# EAGLE design CROSSOVER_MONO_FINISHED_KRE_rev3_dec (EAGLE 7.1.0)
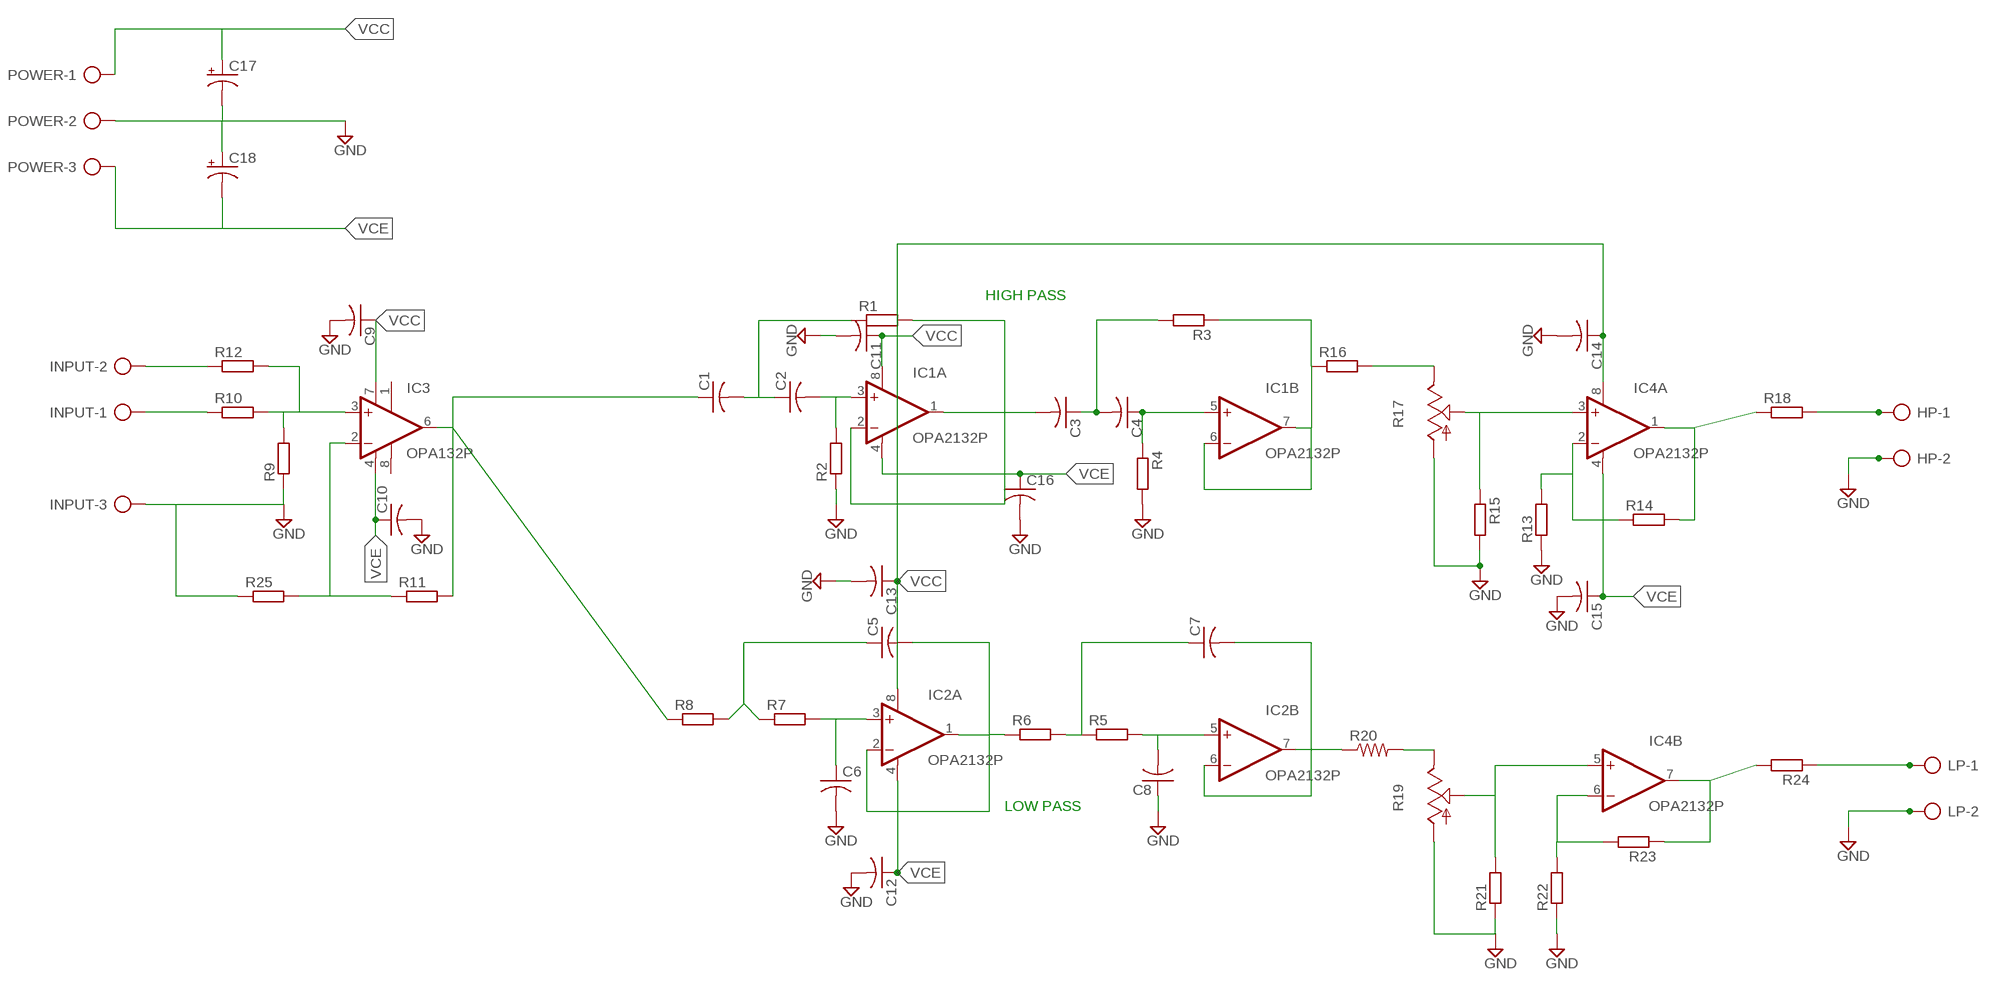
[diagram p0: schematic, sheet 1]

## Parts
C1  C-US050-025X075  [C050-025X075]
C2  C-US050-025X075  [C050-025X075]
C3  C-US050-025X075  [C050-025X075]
C4  C-US050-025X075  [C050-025X075]
C5  C-US050-025X075  [C050-025X075]
C6  C-US050-025X075  [C050-025X075]
C7  C-US050-025X075  [C050-025X075]
C8  C-US050-025X075  [C050-025X075]
C9  C-US050-025X075  [C050-025X075]
C10  C-US050-025X075  [C050-025X075]
C11  C-US050-025X075  [C050-025X075]
C12  C-US050-025X075  [C050-025X075]
C13  C-US050-025X075  [C050-025X075]
C14  C-US050-025X075  [C050-025X075]
C15  C-US050-025X075  [C050-025X075]
C16  C-US050-025X075  [C050-025X075]
C17  CPOL-USE5-10.5  [E5-10,5]
C18  CPOL-USE5-10.5  [E5-10,5]
HP  KRE_2VIAS  [KRE_2VIAS]
IC1  OPA2132P  [DIL08]
IC2  OPA2132P  [DIL08]
IC3  OPA132P  [DIL08]
IC4  OPA2132P  [DIL08]
INPUT  KRE_3VIAS  [KRE_3VIAS]
LP  KRE_2VIAS  [KRE_2VIAS]
POWER  KRE_3VIAS  [KRE_3VIAS]
R1  R-EU_0207/10  [0207/10]
R2  R-EU_0207/10  [0207/10]
R3  R-EU_0207/10  [0207/10]
R4  R-EU_0207/10  [0207/10]
R5  R-EU_0207/10  [0207/10]
R6  R-EU_0207/10  [0207/10]
R7  R-EU_0207/10  [0207/10]
R8  R-EU_0207/10  [0207/10]
R9  R-EU_0207/10  [0207/10]
R10  R-EU_0207/10  [0207/10]
R11  R-EU_0207/10  [0207/10]
R12  R-EU_0207/10  [0207/10]
R13  R-EU_0207/10  [0207/10]
R14  R-EU_0207/10  [0207/10]
R15  R-EU_0207/10  [0207/10]
R16  R-EU_0207/10  [0207/10]
R17  TRIM_US-RJ9W  [RJ9W]
R18  R-EU_0207/10  [0207/10]
R19  TRIM_US-RJ9W  [RJ9W]
R20  R-US_0204/7  [0204/7]
R21  R-EU_0207/10  [0207/10]
R22  R-EU_0207/10  [0207/10]
R23  R-EU_0207/10  [0207/10]
R24  R-EU_0207/10  [0207/10]
R25  R-EU_0207/10  [0207/10]

## Nets
GND: C6.2 C8.1 C9.2 C10.2 C11.2 C12.2 C13.2 C14.2 C15.2 C16.2 C17.- C18.+ HP.2 INPUT.3 LP.2 POWER.2 R2.1 R4.2 R9.1 R13.1 R15.2 R17.A R19.A R21.1 R22.1 R25.1
N$1: C3.1 C4.2 R3.2
N$2: C5.2 IC2.1(A:OUT) IC2.2(A:-IN) R6.1
N$3: C6.1 IC2.3(A:+IN) R7.2
N$4: C5.1 R7.1 R8.2
N$5: C7.2 IC2.6(B:-IN) IC2.7(B:OUT) R20.1
N$6: C7.1 R5.1 R6.2
N$7: C8.2 IC2.5(B:+IN) R5.2
N$8: IC1.6(B:-IN) IC1.7(B:OUT) R3.1 R16.1
N$9: C2.2 IC1.3(A:+IN) R2.2
N$10: C4.1 IC1.5(B:+IN) R4.1
N$11: C3.2 IC1.1(A:OUT) IC1.2(A:-IN) R1.2
N$12: C1.1 IC3.6(OUT) R8.1 R11.2
N$13: C1.2 C2.1 R1.1
N$14: IC3.3(+IN) R9.2 R10.2 R12.2
N$15: INPUT.1 R10.1
N$17: IC3.2(-IN) R11.1 R25.2
N$18: INPUT.2 R12.1
N$19: IC4.1(A:OUT) R14.2 R18.1
N$20: IC4.2(A:-IN) R13.2 R14.1
N$22: R16.2 R17.E
N$23: IC4.3(A:+IN) R15.1 R17.S
N$24: HP.1 R18.2
N$25: R19.E R20.2
N$26: LP.1 R24.1
N$27: IC4.7(B:OUT) R23.1 R24.2
N$29: IC4.6(B:-IN) R22.2 R23.2
N$30: IC4.5(B:+IN) R19.S R21.2
VCC: C9.1 C11.1 C13.1 C14.1 C17.+ IC1.8(A:V+) IC2.8(A:V+) IC3.7(V+) IC4.8(A:V+) POWER.1
VCE: C10.1 C12.1 C15.1 C16.1 C18.- IC1.4(A:V-) IC2.4(A:V-) IC3.4(V-) IC4.4(A:V-) POWER.3
Unconnected: IC3.1(TRIM1) IC3.8(TRIM2)

## Notes on the sheet
- HIGH PASS
- LOW PASS

## Library data of the parts
C1-C16 = resistor:C-US: CAPACITOR, American symbol
C17 C18 = resistor:CPOL-US: POLARIZED CAPACITOR, American symbol
HP LP = Controle_de_pedais:KRE_2VIAS
IC1 IC2 IC4 = burr-brown:OPA2132: High Speed FET-Input Operational Amplifiers< Product Folder:OPA2132; MPN: OPA2132P; OC_FARNELL: 1212432; OC_NEWARK: 47P7461
IC3 = burr-brown:OPA132: Operational Amplifiers High Speed FET-Input; OC_FARNELL: unknown; OC_NEWARK: unknown
INPUT POWER = Controle_de_pedais:KRE_3VIAS
R1-R16 R18 R21-R25 = resistor:R-EU_: RESISTOR, European symbol
R17 R19 = pot:TRIM_US-: POTENTIOMETER
R20 = resistor:R-US_: RESISTOR, American symbol

## Board
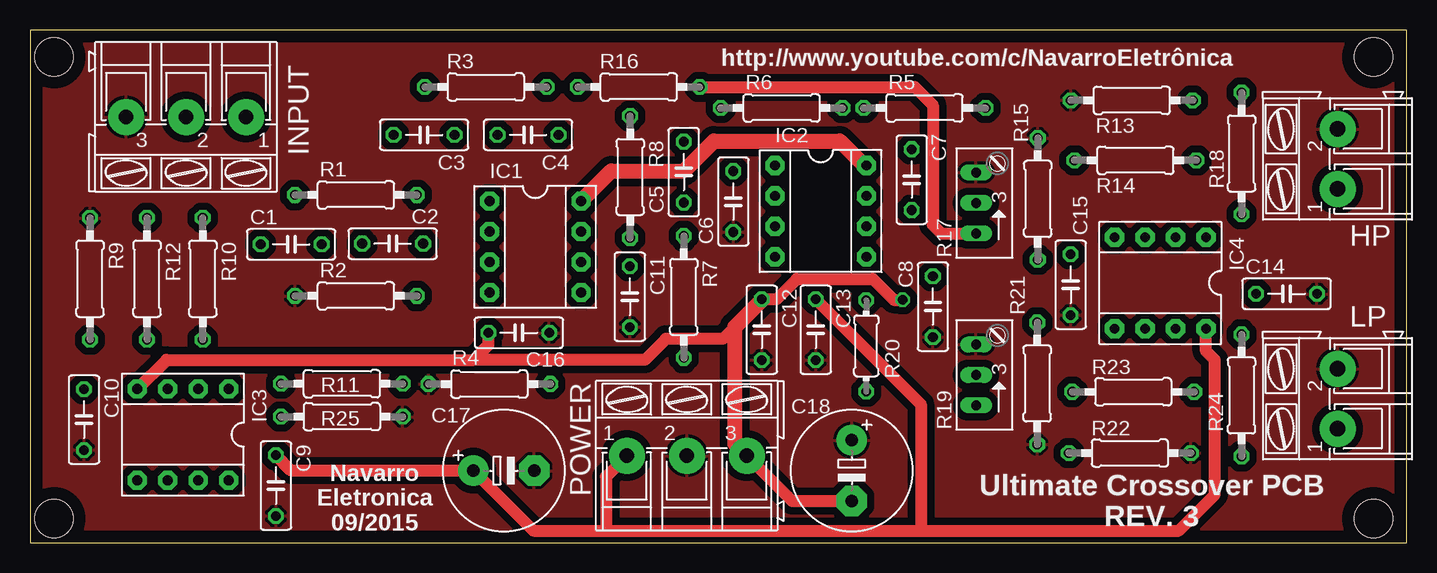
[diagram p1: board, top side]
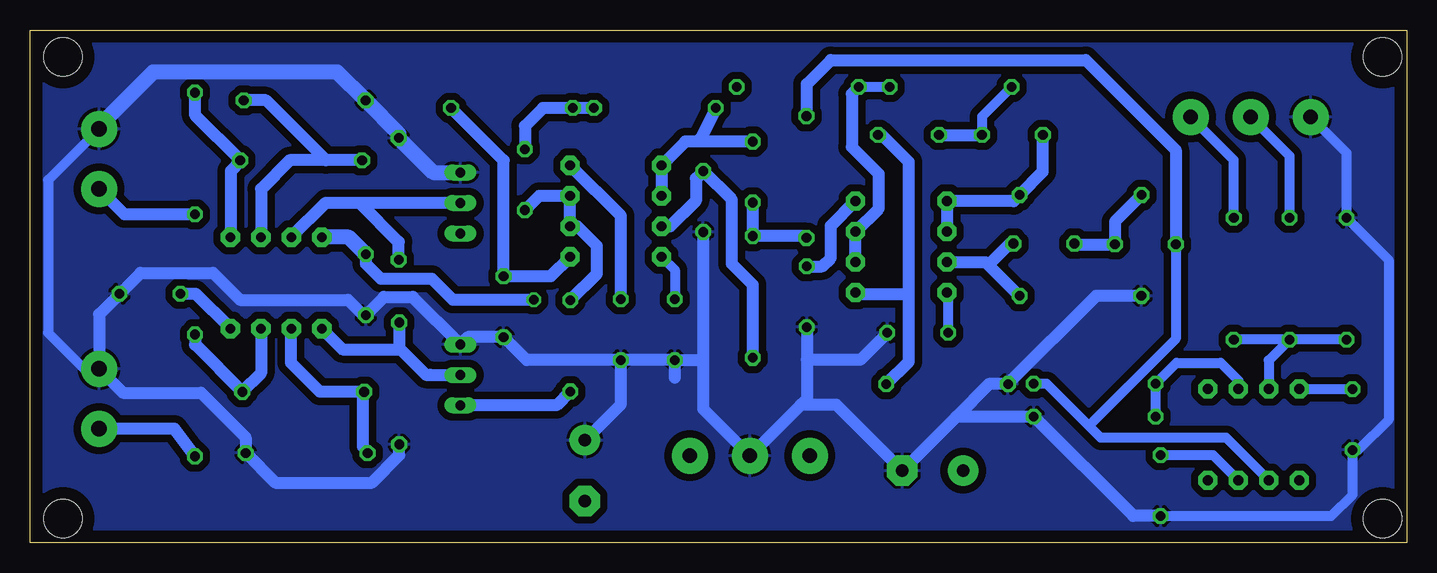
[diagram p2: board, bottom side, seen from below]

Size 114.75 x 42.75 mm. Coordinates in mm from the lower left corner, seen from the top.
Outline: 0,0 114.75,0 114.75,42.75 0,42.75 0,0
Copper layers (1*16): Top 0.035mm / dielectric 1.5mm / Bottom 0.035mm
Design rules "default": minimum track width 10mil, minimum drill 24mil, track to track 8mil, track to pad 8mil, pad to pad 8mil, via to via 8mil, smd to smd 8mil, copper to edge 40mil, drill to drill 8mil, minimum pad ring 10mil, minimum via ring 8mil, stop-mask expansion 4mil, vias tented up to drill 0mil, thermal gap 10mil
Holes 3.2 mm at 2,40.5 112,40.5 112,2 2,2

### Footprints (pad centres in the part's own frame; a part is rotated, then mirrored left to right if it is on the bottom)
C050-025X075 = drill 0.813 octagon: 1 -2.54,0; 2 2.54,0
E5-10,5 = drill 1.016 pad 2.54: + -2.54,0 | drill 1.016 pad 2.54 octagon: - 2.54,0
KRE_2VIAS = drill 1.321 pad 3: 1 -2.5,0; 2 2.5,0
DIL08 = drill 0.813 pad 1.6 octagon: 1 -3.81,-3.81; 2 -1.27,-3.81; 3 1.27,-3.81; 4 3.81,-3.81; 5 3.81,3.81; 6 1.27,3.81; 7 -1.27,3.81; 8 -3.81,3.81
KRE_3VIAS = drill 1.2 pad 3: 1 -5,0; 2 0,0; 3 5,0
0207/10 = drill 0.813 octagon: 1 -5.08,0; 2 5.08,0
RJ9W = drill 0.813 long: A 2.54,0.635; E -2.54,0.635; S 0,0.635
0204/7 = drill 0.813 octagon: 1 -3.81,0; 2 3.81,0

### Placement (x,y rotation side)
C1  21.77,24.87 0 top
C2  30.23,24.93 0 top
C3  32.85,34 180 top
C4  41.51,34 180 top
C5  54.5,30.9 90 top
C6  58.63,28.44 270 top
C7  73.5,30.26 270 top
C8  75.27,19.67 90 top
C9  20.5,4.75 270 top
C10  4.5,10.25 270 top
C11  50,20.5 270 top
C12  61,17.75 270 top
C13  65.5,17.75 270 top
C14  104.75,20.75 0 top
C15  86.75,21.5 270 top
C16  40.75,17.5 0 top
C17  39.5,6 0 top
C18  68.5,6 270 top
HP  109,32 90 top
IC1  42.12,24.66 270 top
IC2  65.91,27.64 270 top
IC3  12.75,9 180 top
IC4  94.23,21.65 180 top
INPUT  13,35.5 180 top
LP  109,12 90 top
POWER  54.75,7.25 0 top
R1  27.17,28.99 0 top
R2  27.17,20.57 0 top
R3  38,38 180 top
R4  38.3,13.22 180 top
R5  74.57,36.25 0 top
R6  62.66,36.25 0 top
R7  54.5,20.49 270 top
R8  50.03,30.49 270 top
R9  5,22 270 top
R10  14.41,22 270 top
R11  26,13.25 0 top
R12  9.75,22 270 top
R13  91.85,36.88 0 top
R14  92.15,31.88 0 top
R15  84.01,28.66 90 top
R16  50.75,38 0 top
R17  79.5,28.32 90 top
R18  101,32.45 270 top
R19  79.5,13.98 90 top
R20  69.71,16.4 270 top
R21  83.97,13.27 90 top
R22  91.69,7.46 180 top
R23  91.97,12.57 180 top
R24  101,12.27 90 top
R25  26,10.5 180 top

### Tracks (layer width: path | path; a pad name or v marks a point on that pad's centre or on a via)
GND
  Bottom 0.813: INPUT.3 5,32.5 R9.1 1.5,23.58 1.5,10.25 4.04,7.71 C10.2 4.5,4 6.29,2.21 C9.2 | HP.2 113.25,30.25 113.25,17.5 110.25,14.5 LP.2
  Bottom 1.016: R21.1 83.97,7.29 86.25,5 94.31,5 R22.1 96.77,8.77 100.5,12.5 107,12.5 LP.2 109,19.04 C14.2 105.54,22.5 99.5,22.5 97.25,20.25 88.25,20.25 86.96,18.96 C15.2 86.75,19 85.25,20.5 82.85,20.5 R19.A 78.25,17.13 C8.1 73.35,15.21 C13.2 | C12.2 C13.2 | C11.2 50,15.25 | 50,15.25 50,12 50.5,11.5 | 50.5,11.5 POWER.2 58.63,11.13 58.63,15 | C6.2 58.63,15 | C12.2 58.84,15.21 58.63,15 | 61,13.75 C12.2 | 50.5,11.5 47.54,11.5 C17.- 37.54,10.5 | C18.+ 65.5,11.54 C13.2 | C16.2 45.54,15.25 50,15.25 | C9.2 22.79,2.21 R25.1 37.54,10.5 | 37.54,10.5 34.82,13.22 R4.2 25.86,20.57 R2.1
  Bottom 1.27: HP.2 109,34.75 104.5,39.25 89.14,39.25 R13.1 84.01,34.12 R15.2 81.13,30.86 R17.A
  pour Top (isolate 0.61): 0,43 114.75,43 114.75,0 0,0
  pour Bottom (isolate 0.61): 0,42.75 114.75,43 114.75,0 0,-0.25
N$1
  Bottom 0.813: R3.2 35.39,35.53 C3.1
  Bottom 1.016: C4.2 C3.1
N$2
  Bottom 1.016: IC2.2 IC2.1 60.11,33.44 58.5,33.44 | C5.2 58.5,33.44 | R6.1 58.83,33.77 58.5,33.44
N$3
  Bottom 0.813: 61.96,26.23 IC2.3
  Bottom 1.016: R7.2 54.5,21.5 56.25,23.25 56.25,28.6 C6.1 59.25,30.36 59.25,28.5 61.38,26.37 IC2.3
N$4
  Bottom 1.016: R8.2 50.19,25.57 R7.1 C5.1
N$5
  Bottom 1.016: C7.2 72.31,28.91 IC2.7 IC2.6 69.12,26.37 67.5,24.75 67.5,22.42 R20.1
N$6
  Bottom 1.016: R6.2 R5.1 72,36.25 73.5,34.75 C7.1
N$7
  Bottom 1.016: IC2.5 71.34,22.21 C8.2 75.27,31.87 R5.2
N$8
  Bottom 0.813: R3.1 R16.1
  Bottom 1.016: IC1.6 IC1.7 44,27.86 44,30.75 46.25,33 46.25,37.42 R16.1
N$9
  Bottom 1.016: IC1.3 35.07,23.39 34.84,23.16 | 34.84,23.16 R2.2 | C2.2 33.07,24.93 34.84,23.16
N$10
  Bottom 1.016: R4.1 41.5,15.09 41.5,20.75 | 41.5,20.75 41.5,31.75 43.75,34 C4.1 | IC1.5 45.83,20.75 41.5,20.75
N$11
  Bottom 1.016: IC1.2 IC1.1 32.77,28.47 R1.2 30.31,30.93 C3.2
N$12
  Bottom 0.813: IC3.6 15.04,8.75 25.5,8.75 26.38,9.62 | 26.38,9.62 30,13.25 R11.2 | C1.1 19.25,24.86 19.25,17 26.38,9.88 26.38,9.62
  Bottom 1.016: R8.1 50,35.6 50,38.25 48,40.25 26.75,40.25 19.23,32.73 C1.1
N$13
  Bottom 1.016: C2.1 27.63,24.87 C1.2 24.31,26.77 R1.1
N$14
  Bottom 0.813: R9.2 R12.2 | R12.2 R10.2 | R12.2 11.48,15.19 IC3.3
N$15
  Bottom 0.813: R10.1 14.4,31.91 INPUT.1
N$17
  Bottom 0.813: R25.2 R11.1 19.17,15 15.5,15 14.02,13.52 IC3.2
N$18
  Bottom 0.813: R12.1 9.75,32.25 INPUT.2
N$19  (via drill 0.6)
  Bottom 1.016: IC4.1 v98,25.5 98,31 97.23,31.77 R14.2 100.96,35.61 R18.1
N$20
  Bottom 1.016: R13.2 95.07,36.88 90.07,31.88 | R14.1 90.07,31.88 | 90.07,31.88 93.12,31.88 95.5,29.5 IC4.2
N$22
  Top 1.016: R16.2 73.75,38 75.25,36.5 75.25,26.5 75.97,25.78 R17.E
N$23
  Bottom 1.016: R17.S 87.25,28.32 | 87.25,28.32 90.1,28.32 IC4.3 | R15.1 84.01,25.08 87.25,28.32
N$24
  Bottom 1.016: R18.2 106.87,27.37 HP.1
N$25
  Bottom 1.016: R20.2 70.86,11.44 R19.E
N$26
  Bottom 1.016: R24.1 102.7,9.5 LP.1
N$27
  Bottom 1.016: IC4.7 95.5,14.12 R23.1 101,16.52 R24.2
N$29  (via drill 0.6)
  Bottom 1.016: R22.2 86.61,7.61 87,8 87,12.46 R23.2 90.57,12.57 93,15 v93,17.8 IC4.6
N$30
  Bottom 1.016: R21.2 83.97,16.21 83.88,16.12 | 83.88,16.12 81.75,14 81.39,14 R19.S | IC4.5 88.7,16.12 83.88,16.12
N$31  (via drill 0.9)
  other vias: 2,2
N$35  (via drill 0.9)
  other vias: 2,40.5
N$36  (via drill 0.9)
  other vias: 112,40.5
N$37  (via drill 0.9)
  other vias: 112,2
VCC
  Top 1.016: C9.1 21.79,6 C17.+ 41.96,1 48,1 | 48,1 74.25,1 | 74.25,1 95.75,1 98.75,4 98.75,15.25 98.04,15.96 IC4.8 | POWER.1 48,5.5 48,1 | C13.1 74.25,11.54 74.25,1
  Top 1.27: IC1.8 48.46,31 54.5,31 57,33.5 67.5,33.5 69.55,31.45 IC2.8
  Bottom 0.813: IC3.7 16.12,7.29 C9.1
  Bottom 1.016: IC4.8 100.95,20.75 C14.1 | C13.1 65.5,27.23 IC2.8 | C11.1 48.71,23.04 48,23.75 48,26.4 IC1.8
VCE  (via drill 0.8)
  Top 1.016: POWER.3 63.54,3.46 C18.- | IC3.4 11.38,15.25 37,15.25 | 37,15.25 38.21,16.46 C16.1 | 58.75,18 57.75,17 53,17 51.25,15.25 37,15.25 | v72.75,20.25 72,20.25 70.25,22 63.93,22 62.22,20.29 C12.1
  Top 1.27: POWER.3 58.75,8.25 58.75,18 61,20.25 C12.1
  Bottom 0.813: C10.1 8.92,12.79 IC3.4 | IC1.4 38.21,20.75 C16.1 | IC2.4 61,22.73 C12.1
  Bottom 1.016: v72.75,20.25 79.5,20.25 81.25,22 85.5,22 86.75,23.25 C15.1
  Bottom 1.27: C15.1 88.17,25.46 IC4.4

### Text on the board
tNames: http://www.youtube.com/c/NavarroEletrônica | Navarro / Eletronica / 09/2015 | Ultimate Crossover PCB / REV. 3